# Altium schematic sheet STM32_Schematic.SchDoc
size A4; SheetNumber: 1; SheetTotal: 1
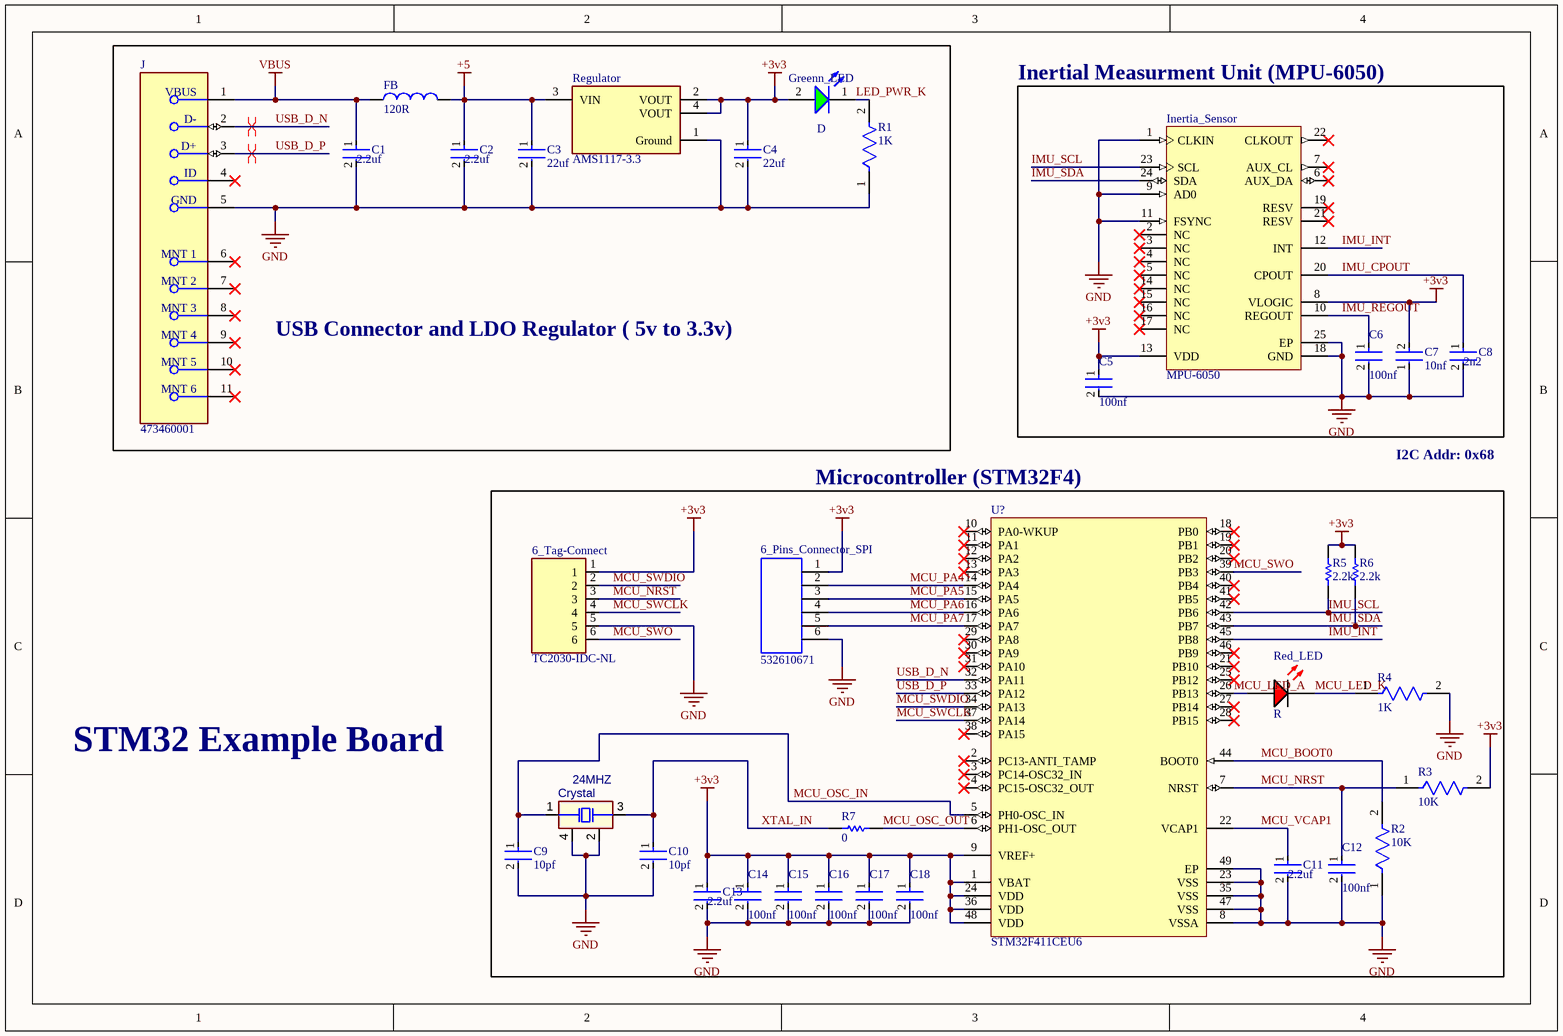
[diagram p0: STM32_Schematic.SchDoc]

## Parts
6_Pins_Connector_SPI  532610671  [CONN_532610001-SD_06_MOL]
6_Tag-Connect  TC2030-IDC-NL  [TAG_TC2030-IDC-NL]
C1  2.2uf  [FP-0402-L_1_0_0_10-W_0_5-IPC_B]
C2  2.2uf  [FP-0402-L_1_0_0_10-W_0_5-IPC_B]
C3  22uf  [FP-CL31-IPC_B]
C4  22uf  [FP-CL31-IPC_B]
C5  100nf  [FP-GMD155-0_05-IPC_B]
C6  100nf  [FP-GMD155-0_05-IPC_B]
C7  10nf  [FP-C0402-BB-IPC_B]
C8  2n2  [FP-0402-L_1_0_0_10-W_0_5-IPC_B]
C9  10pf  [FP-C0402-BB-IPC_B]
C10  10pf  [FP-C0402-BB-IPC_B]
C11  2.2uf  [FP-0402-L_1_0_0_10-W_0_5-IPC_B]
C12  100nf  [FP-GMD155-0_05-IPC_B]
C13  2.2uf  [FP-0402-L_1_0_0_10-W_0_5-IPC_B]
C14  100nf  [FP-GMD155-0_05-IPC_B]
C15  100nf  [FP-GMD155-0_05-IPC_B]
C16  100nf  [FP-GMD155-0_05-IPC_B]
C17  100nf  [FP-GMD155-0_05-IPC_B]
C18  100nf  [FP-GMD155-0_05-IPC_B]
Crystal  24MHZ  [EPSON-FA-128_V]
FB  120R  [WE-CBF_1206_L3.2W1.6H1.1_HC]
Greenn_LED  D  [WL-SMCC_0402_L1W0.5H0.4]
Inertia_Sensor  MPU-6050  [IS-QFN-24_V]
J  473460001  [FP-473460001-MFG]
R1  1K  [FP-CR0402-IPC_C]
R2  10K  [FP-CRCW0402-e3-IPC_B]
R3  10K  [FP-CRCW0402-e3-IPC_B]
R4  1K  [FP-CR0402-IPC_C]
R5  2.2k  [RESC1005X40X25NL05T05]
R6  2.2k  [RESC1005X40X25NL05T05]
R7  value 0  [RESC1005X40X25NL05T10]  (hidden comment: 0R)
Red_LED  R  [PNSC-CHIP-2_V]
Regulator  AMS1117-3.3  [FP-AMS1117-IPC_C]
U?  STM32F411CEU6  [STM-UFQFPN48_L]

## Blocks framed on the sheet
USB Connector and LDO Regulator ( 5v to 3.3v): C1-C4 FB Greenn_LED J R1 Regulator
Inertial Measurment Unit (MPU-6050): C5-C8 Inertia_Sensor
Microcontroller (STM32F4): 6_Pins_Connector_SPI 6_Tag-Connect C9-C18 Crystal R2-R7 Red_LED U?

## Nets
+3v3: 6_Pins_Connector_SPI.1 6_Tag-Connect.1 C4.1 C5.1 C7.2 C13.1 C14.1 C15.1 C16.1 C17.1 C18.1 Greenn_LED.2(A) Inertia_Sensor.8(VLOGIC) Inertia_Sensor.13(VDD) R3.2 R5.2 R6.2 Regulator.2(VOUT) Regulator.4(VOUT) U?.1(VBAT) U?.9(VREF+) U?.24(VDD) U?.36(VDD) U?.48(VDD)
+5: C2.1 C3.1 FB.2 Regulator.3(VIN)
GND: 6_Pins_Connector_SPI.6 6_Tag-Connect.5 C1.2 C2.2 C3.2 C4.2 C5.2 C6.2 C7.1 C8.2 C9.2 C10.2 C11.2 C12.2 C13.2 C14.2 C15.2 C16.2 C17.2 C18.2 Crystal.2(NC) Crystal.4(NC) Inertia_Sensor.1(CLKIN) Inertia_Sensor.9(AD0) Inertia_Sensor.11(FSYNC) Inertia_Sensor.18(GND) Inertia_Sensor.25(EP) J.5(GND) R1.1 R2.1 R4.2 Regulator.1(Ground) U?.8(VSSA) U?.23(VSS) U?.35(VSS) U?.47(VSS) U?.49(EP)
VBUS: C1.1 FB.1 J.1(VBUS)
IMU_CPOUT: C8.1 Inertia_Sensor.20(CPOUT)
IMU_INT: Inertia_Sensor.12(INT) U?.45(PB8)
IMU_REGOUT: C6.1 Inertia_Sensor.10(REGOUT)
IMU_SCL: Inertia_Sensor.23(SCL) R5.1 U?.42(PB6)
IMU_SDA: Inertia_Sensor.24(SDA) R6.1 U?.43(PB7)
LED_PWR_K: Greenn_LED.1(K) R1.2
MCU_BOOT0: R2.2 U?.44(BOOT0)
MCU_LED_A: Red_LED.1(ANODE) U?.26(PB13)
MCU_LED_K: R4.1 Red_LED.2(CATHODE)
MCU_NRST: 6_Tag-Connect.3 C12.1 R3.1 U?.7(NRST)
MCU_OSC_IN: C9.1 Crystal.1(X1) U?.5(PH0-OSC_IN)
MCU_OSC_OUT: R7.2 U?.6(PH1-OSC_OUT)
MCU_PA4: 6_Pins_Connector_SPI.2 U?.14(PA4)
MCU_PA5: 6_Pins_Connector_SPI.3 U?.15(PA5)
MCU_PA6: 6_Pins_Connector_SPI.4 U?.16(PA6)
MCU_PA7: 6_Pins_Connector_SPI.5 U?.17(PA7)
MCU_SWCLK: 6_Tag-Connect.4 U?.37(PA14)
MCU_SWDIO: 6_Tag-Connect.2 U?.34(PA13)
MCU_SWO: 6_Tag-Connect.6 U?.39(PB3)
MCU_VCAP1: C11.1 U?.22(VCAP1)
USB_D_N: J.2(D-) U?.32(PA11)
USB_D_P: J.3(D+) U?.33(PA12)
XTAL_IN: C10.1 Crystal.3(X2) R7.1

Not connected (* = marked no-connect by the designer): Inertia_Sensor 2(NC)* 3(NC)* 4(NC)* 5(NC)* 6(AUX_DA)* 7(AUX_CL)* 14(NC)* 15(NC)* 16(NC)* 17(NC)* 19(RESV)* 21(RESV)* 22(CLKOUT)*; J 4(ID)* 6(MNT_1)* 7(MNT_2)* 8(MNT_3)* 9(MNT_4)* 10(MNT_5)* 11(MNT_6)*; U? 2(PC13-ANTI_TAMP)* 3(PC14-OSC32_IN)* 4(PC15-OSC32_OUT)* 10(PA0-WKUP)* 11(PA1)* 12(PA2)* 13(PA3)* 18(PB0)* 19(PB1)* 20(PB2)* 21(PB10)* 25(PB12)* 27(PB14)* 28(PB15)* 29(PA8)* 30(PA9)* 31(PA10)* 38(PA15)* 40(PB4)* 41(PB5)* 46(PB9)*

## Layout directives
differential pair; differential pair class BIFF_USB: USB_D_N, USB_D_P

## Notes on the sheet
- I2C Addr: 0x68
- STM32 Example Board

## Library data of the parts
6_Pins_Connector_SPI = 532610671: Conn Shrouded Header (4 Sides) HDR 6 POS 1.25mm Solder RA Side Entry SMD PicoBladeâ„¢ T/R; MF: Molex; SnapEDA_Link: https://www.snapeda.com/parts/532610671/Molex/view-part/?ref=snap; Package: None; Value: *; MP: 532610671; Check_prices: https://www.snapeda.com/parts/532610671/Molex/view-part/?ref=eda
6_Tag-Connect = TC2030-IDC-NL: CABLE ADAPTER 6 POS; Value: *; MP: TC2030-IDC-NL; Availability: Unavailable; Package: None; Price: None
C1 C2 C11 C13 = CMP-14477-003358-2: None; Dielectric: X5R; Voltage Rating: 16V; Tolerance: 20%; Package Quantity: 1; Thickness: 0.022inch; Lead Free: Lead Free; Min Operating Temperature: -55°C; Height: 0.5mm; Halogen Free: Halogen Free; Packaging: Tape and Reel; Termination: SMD/SMT; Case/Package: 0402; Resistor Type: Ceramic; Case Code (Imperial): 0402; Mount: Surface Mount; RoHS Compliant: Yes; Width: 0.02inch; Case Code (Metric): 1005; Voltage Rating (DC): 16V; Capacitance: 2.2uF; Max Operating Temperature: 85°C; Length: 1mm
C3 C4 = CMP-13271-003943-1: Cap Ceramic 22uF 16V X6S ±10% SMD 1206 +105°C Embossed T/R; Package Quantity: 1; Case/Package: 1206; Min Operating Temperature: -55°C; Dielectric: X6S; Capacitance: 22uF; Radiation Hardening: No; Mount: Surface Mount; Packaging: Tape and Reel; Width: 0.063inch; Length: 3.2mm; Case Code (Imperial): 1206; Case Code (Metric): 3216; Voltage Rating: 16V; Height: 1.6mm; Thickness: 0.071inch; Max Operating Temperature: 105°C; Depth: 1.6mm; Tolerance: 10%
C5 C6 C12 C14-C18 = CMP-06035-061958-1: Wire Bonding/AuSn Soldering Mount Chip Multilayer Ceramic Capacitors for General Purpose, 0402, 0.10uF, X5R, 15%, 20%, 16V
C7 = CMP-2008-03066-2: Multilayer Ceramic Capacitor, C Series, 0.01 - F, - 5%, X7R, 16 V, 0402 [1005 Metric] Rohs Compliant: Yes; Manufacturer Part Number: C0402C103J4RACTU; Manufacturer: Kemet; Temperature Coefficient: 15%; Tolerance: 0.05; Value: 10,000 pF; Voltage Rating: 16 V; Octopart: https://octopart.com/c0402c103j4ractu-kemet-128602; Temperature Range High: +125°C; Height: 0.55mm; Lead Free: Yes; RoHS: TRUE; Device Class L2: Capacitors; Temperature: -55°C to +125°C; ComponentLink2URL: https://content.kemet.com/datasheets/KEM_C1002_X7R_SMD.pdf; Mouser Description: Multilayer Ceramic Capacitors MLCC - SMD/SMT 16volts 10000pF X7R 5%; Capacitance: 10,000 pF; Device Class L1: Passive Components; Ipc Land Pattern Name: CAPC10050X50; Temperature Range Low: -55°C; Digikey Description: Multilayer Ceramic Capacitor, C Series, 0.01 - F, - 5%, X7R, 16 V, 0402 [1005 Metric] Rohs Compliant: Yes; Device Class L3: Ceramic Capacitors; Temperature Characteristic: X7R; ComponentLink2Description: Datasheet; Package: C0402-BB; Category: Cap; Material: Ceramic; Automotive: No
C8 = CMP-14477-003358-2: None; Dielectric: X5R; Voltage Rating: 16V; Capacitance: 2.2uF; Tolerance: 20%; Package Quantity: 1; Thickness: 0.022inch; Lead Free: Lead Free; Min Operating Temperature: -55°C; Height: 0.5mm; Halogen Free: Halogen Free; Packaging: Tape and Reel; Termination: SMD/SMT; Case/Package: 0402; Resistor Type: Ceramic; Case Code (Imperial): 0402; Mount: Surface Mount; RoHS Compliant: Yes; Width: 0.02inch; Case Code (Metric): 1005; Voltage Rating (DC): 16V; Max Operating Temperature: 85°C; Length: 1mm
C9 C10 = CMP-03020-005426-2: CAP CER 10PF 16V NP0 0402; Manufacturer Part Number: C0402C100J4GAC7867; Manufacturer: Kemet; Temperature Characteristic: C0G; Temperature Coefficient: 15%; Tolerance: 0.05; Material: Ceramic; Octopart: https://octopart.com/c0402c100j4gac7867-kemet-1500972; Package: C0402-BB; Ipc Land Pattern Name: CAPC10050X50; Temperature Range Low: -55°C; ComponentLink2URL: https://content.kemet.com/datasheets/KEM_C1002_X7R_SMD.pdf; ComponentLink2Description: Datasheet; Device Class L2: Capacitors; Lead Free: Yes; Temperature Range High: +125°C; Device Class L1: Passive Components; Automotive: No; Category: Cap; Height: 0.55mm; Capacitance: 10 pF; Digikey Description: CAP CER 10PF 16V NP0 0402; Device Class L3: Ceramic Capacitors; Value: 10 pF; Voltage Rating: 16 V; Temperature: -55°C to +125°C; RoHS: TRUE
Crystal = CMP-003-00028-1: Crystal, 24 MHz, +/- 10 ppm, -20 to 75 degC, 4-Pin SMD, RoHS, Tape and Reel; Load Capacitance: 12pF; ESR: 80; Mounting Technology: SMT; Pins: 4; Case/Package: SMD/SMT; Frequency: 24MHz; Min Operating Temperature: -20°C; RoHS Compliant: Yes; Max Operating Temperature: 75°C
FB = CMP-0220-00020-2: NexarPartId: 7861705; Max DC Current: 3A; Shielding: Unshielded; Resistance: 30mΩ; Inductance: 20.8nH; Test Frequency: 100MHz; Impedance: 120Ω; Tolerance: 25%; Number of Lines: 1; Height: 1.1mm; Case Code (Imperial): 1206; Mount: Surface Mount; Min Operating Temperature: -55°C; Current Rating: 3A; Weight: 28.009329mg; Termination: SMD/SMT; Width: 1.6mm; DC Resistance (DCR): 30mΩ; Length: 3.2mm; Max Operating Temperature: 125°C; RoHS: Compliant; Max Current Rating: 3A; Core Material: Ferrite; Case Code (Metric): 3216; REACH SVHC: Unknown; Packaging: Digi-Reel®; Depth: 1.6mm; Case/Package: SMD/SMT; Lead Free: Lead Free
Greenn_LED = CMP-03913-90235559-3: Wurth Elektronik LED, WL-SMCC, 1005 (0402), 570 nm, 1 x 0.5 x 0.4mm; Manufacturer Lifecycle Status: ACTIVE; Luminous Intensity: 50mcd; Wavelength: 570nm; Power Dissipation: 75mW; YEOL: 1 = Estimated lifetime > 10 years; Reverse Voltage: 5V; Forward Current: 60mA; Peak Wavelength: 572nm; Max Junction Temperature (Tj): 95°C; Viewing Angle: 120°; Forward Voltage: 2V; Min Operating Temperature: -40°C; Height: 400µm; Max Operating Temperature: 85°C; Width: 500µm; Color: Green; Dominant Wavelength: 570nm; Packaging: Tape and Reel; Max Reverse Voltage (DC): 5V; RoHS: Compliant; Case/Package: 0402; Lifecycle Status: Production; Length: 1mm
Inertia_Sensor = CMP-1753-00002-2: 3-Axis Gyroscope, Accelerometer and a Digital Motion Processor(TM) (DMP), 2.375 to 3.46 V, -40 to 85 degC, 24-Pin QFN, RoHS, Tape and Reel; Manufacturer: InvenSense; Featured Product: MPU-60506-Axis,IntegratedI²CSolution; Other Names: 1428-1007-2 / MPU6050; Sensor Type: MotionTracking; Online Catalog: MPU-6000™Series; Unit PriceUSD: Digital; Datasheet Version: Rev. 3.3, 05/2012; Category: Sensors,Transducers; Datasheet URL: http://datasheet.octopart.com/MPU-6050-InvenSense-datasheet-14421344.pdf; Family: Multifunction; Standard Package: 5,000; Manufacturer URL: http://www.invensense.com/; Output Type: Digital; Dynamic Catalog: MPU-6000™Series
J = CMP-2000-05246-2: CONN RCPT USB2.0 MICRO B SMD R/A; Manufacturer: Molex; Conn Orientation: Right Angle; Is Female: yes; Shielding: true; Pitch: 0.65mm; Number Of Contacts: 5; Voltage Rating: 30V; Current Rating: 1.8A; Device Class L2: USB Connectors; Digikey Description: CONN RCPT USB2.0 MICRO B SMD R/A; Height: 2.945mm; RoHS: TRUE; ComponentLink2Description: Datasheet; Octopart: https://octopart.com/47346-0001-molex-7164928; Automotive: No; Package: 0; Category: Conn; Device Class L1: Connectors; Usb Standard: USB 2.0; Temperature: -30°C to +85°C; Temperature Range Low: -30°C; Footprint Url: https://www.molex.com/pdm_docs/sd/473460001_sd.pdf; ComponentLink2URL: https://www.molex.com/webdocs/datasheets/pdf/en-us/0473460001_IO_CONNECTORS.pdf; Lead Free: Yes; Manufacturer Part Number: 473460001; Contact Material: Gold,Nickel; Temperature Range High: +85°C; Device Class L3: unset
R1 R4 = CMP-2002-05519-2: Thick Film Chip Resistors 0402 1kΩ 0.0625W 5% 200ppm/°C; Power Rating: 62.5mW; Resistance: 1kR; Max Power Dissipation: 63mW; Voltage Rating: 50V; Length: 1mm; Width: 0.02inch; Tolerance: 5%; Composition: Thick Film; Max Operating Temperature: 125°C; Termination: SMD/SMT; Package Quantity: 10000; Mount: Surface Mount; Number of Terminations: 2; Case/Package: 0402; Height: 0.016inch; Military Standard: Not; Case Code (Imperial): 0402; Contact Plating: Tin; Temperature Coefficient: 200ppm/°C; Min Operating Temperature: -55°C; Case Code (Metric): 1005; Packaging: Tape and Reel; Depth: 0.5mm; Radiation Hardening: No; Thickness: 356um
R2 R3 = CMP-2002-08136-3: RES Thick Film, 10kΩ, 5%, 0.063W, 200ppm/°C, 0402; Voltage Rating: 50V; Power Rating: 63mW; Resistance: 10kR; Military Standard: Not; Packaging: Tape and Reel; Case Code (Imperial): 0402; Min Operating Temperature: -55°C; Case Code (Metric): 1005; Case/Package: 0402; Temperature Coefficient: 200ppm/°C; Termination: SMD/SMT; Composition: Thick Film; Depth: 0.5mm; Number of Terminations: 2; Contact Plating: Tin; Height: 0.016inch; Width: 0.5mm; Max Operating Temperature: 155°C; Features: Automotive AEC-Q200; Length: 1mm; Radiation Hardening: No; Max Power Dissipation: 63mW; Mount: Surface Mount; Tolerance: 5%; Package Quantity: 1; Weight: 2.3E-05oz
R5 R6 = CMP-2002-08453-1: Manufacturer: Vishay Dale; Part Number: CRCW04022K20JNED
R7 = CMP-009-00008-5: Chip Resistor, 0 Ohm, 0.25 W, -55 to 155 degC, 1206 (3216 Metric); Tolerance: 0.05%; Voltage Rating: 200V; Power: 250mW; Pins: 2; Min Operating Temperature: -55°C; RoHS Compliant: True; Max Operating Temperature: 155°C; Mounting Technology: SM; Case/Package: 1206
Red_LED = CMP-0456-00001-2: Hight Bright Surface Mounting Chip LED (Red), 55 mW, -30 to 85 degC, 1.0 x 0.5 x 0.2 mm  SMD; PartNumber: LNJ247W82RA; Manufacturer: Panasonic; Forward Voltage: 1.95 V; Reverse Current: 100 uA; Spectral half band width: 20 nm; Dominant Emission Wavelength: 630 nm; Luminous Intensity: 16 mcd; Peak Emission Wavelength: 645 nm; Mounting Technology: Surface Mount; PackageReference: CHIP-2; ComponentLink1URL: http://www.semicon.panasonic.co.jp/en/; ComponentLink3Description: Package Specification; PackageDescription: 2-Pin CHIP, Body 1x0.5mm, Pitch 0.7mm; ComponentLink2URL: http://www.semicon.panasonic.co.jp/ds4/LNJ247W82RA_E.pdf; ComponentLink3URL: http://www.semicon.panasonic.co.jp/ds4/LNJ247W82RA_E.pdf; ComponentLink1Description: Manufacturer URL; ComponentLink2Description: Datasheet
Regulator = CMP-209535-000001-1: LDO Voltage Regulators 1A, 3.3V; Manufacturer: Advanced Monolithic Systems; Dropout Voltage: 1.1V; Output Type: Fixed; Nominal Supply Current: 5mA; Max Power Dissipation: 1.2W; Max Supply Voltage: 15V; Number Of Outputs: 1; Standoff Height: 0.64mm; Max Junction Temp: +125°C; Height: 1.8mm; Package: AMS1117; Device Class L2: Power Management ICs; ComponentLink2Description: Datasheet; ComponentLink2URL: http://www.advanced-monolithic.com/pdf/ds1117.pdf; Category: IC; RoHS: TRUE; Automotive: No; Device Class L1: Integrated Circuits (ICs); Output Current: 1A; Device Class L3: Voltage Regulators - Linear; Temperature: -40°C to +125°C; Output Voltage: 3.3V; Manufacturer Part Number: AMS1117-3.3; Temperature Range Low: -40°C; Octopart: https://octopart.com/ams1117-3.3-advanced+monolithic+systems-25899300; Lead Free: Yes; Ipc Land Pattern Name: SOT229P700X180-4; Temperature Range High: +125°C; Supplier: RS; Supplier Part Number: 1241867P
U? = CMP-0243-00165-1: ARM Cortex-M4 32-bit MCU+FPU, 512 KB Flash, 128 KB RAM, 36 I/Os, 48-Pin UFQFPN, -40 to 85 degC, Tray; Operating Frequency(F) (Processor speed) (MHz): 100; FLASH Size (Prog) (kB): 512; Internal RAM Size (kB): 128; I/Os (High Current): 36; Supply Voltage(Vcc) min (V): 1.7; Package Reference: 48-Pin Ultra Thin Fine Pitch Quad Flat No-Lead, 7 x 7 x 0.6 mm Body, 0.5 mm Pitch, Exposed Pad; ComponentLink1Description: Manufacturer URL; ComponentLink1URL: http://www.st.com/; Packing: Tray; Package Description: UFQFPN48; Core: ARM Cortex-M4; ComponentLink2Description: Datasheet; ComponentLink2URL: http://www.st.com/st-web-ui/static/active/en/resource/technical/document/datasheet/DM00115249.pdf; DatasheetVersion: Rev. 6; Mounting Technology: Surface Mount